# EAGLE design v2_power_board (EAGLE 9.1.0)
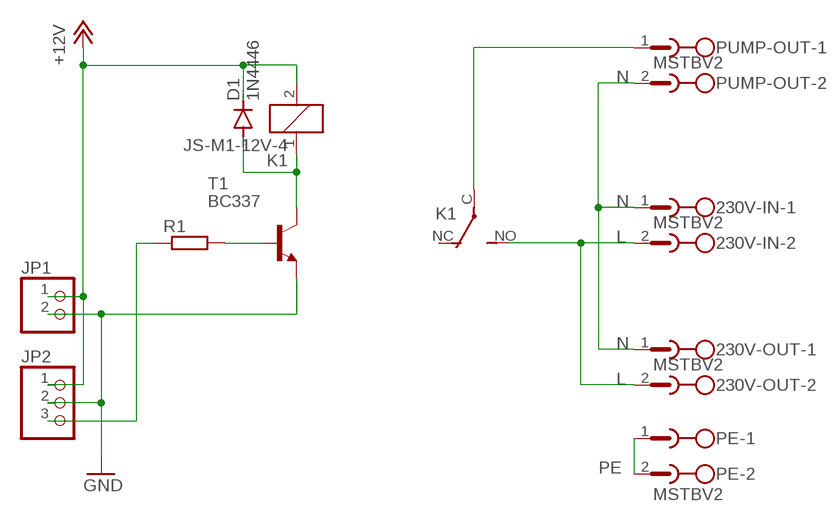
[diagram p0: schematic, sheet 1]

## Parts
230V-IN  MSTBV2  [MSTBV2]
230V-OUT  MSTBV2  [MSTBV2]
D1  1N4446  [DO35-10]
JP1  PINHD-1X2  [1X02]
JP2  PINHD-1X3  [1X03]
K1  JS-M1-12V-4  [JS-M]
PE  MSTBV2  [MSTBV2]
PUMP-OUT  MSTBV2  [MSTBV2]
R1  R-EU_R1206  [R1206]
T1  BC337  [TO92]

## Nets
+12V: D1.C JP1.1 JP2.1 K1.2
GND: JP1.2 JP2.2 T1.1(E)
L: 230V-IN.2 230V-OUT.2 K1.NO(2:S)
N: 230V-IN.1 230V-OUT.1 PUMP-OUT.2
N$6: K1.C(2:P) PUMP-OUT.1
N$8: R1.2 T1.2(B)
N$9: D1.A K1.1 T1.3(C)
N$10: JP2.3 R1.1
PE: PE.1 PE.2
Unconnected: K1.NC(2:O)

## Library data of the parts
230V-IN 230V-OUT PE PUMP-OUT = con-phoenix-508:MSTBV2: PHOENIX; MPN: MSTBV 2,5/2-GF-5.08; OC_FARNELL: 1792792; OC_NEWARK: 69R9845
D1 = diode:1N4446: DIODE high speed (Philips)
JP1 = pinhead:PINHD-1X2: PIN HEADER
JP2 = pinhead:PINHD-1X3: PIN HEADER
K1 = relay:JS-M1*: Automotive Ultra-Miniature Power Relay NAiS Source: http://www.mew-europe.com/.. en_ds_61211_0000.pdf; MPN: JSM1-12V-4; OC_FARNELL: 910338; OC_NEWARK: 13P4552
R1 = rcl:R-EU_: RESISTOR, European symbol; SPICEPREFIX: R
T1 = transistor:BC337: NPN TRANSISTOR

## Board
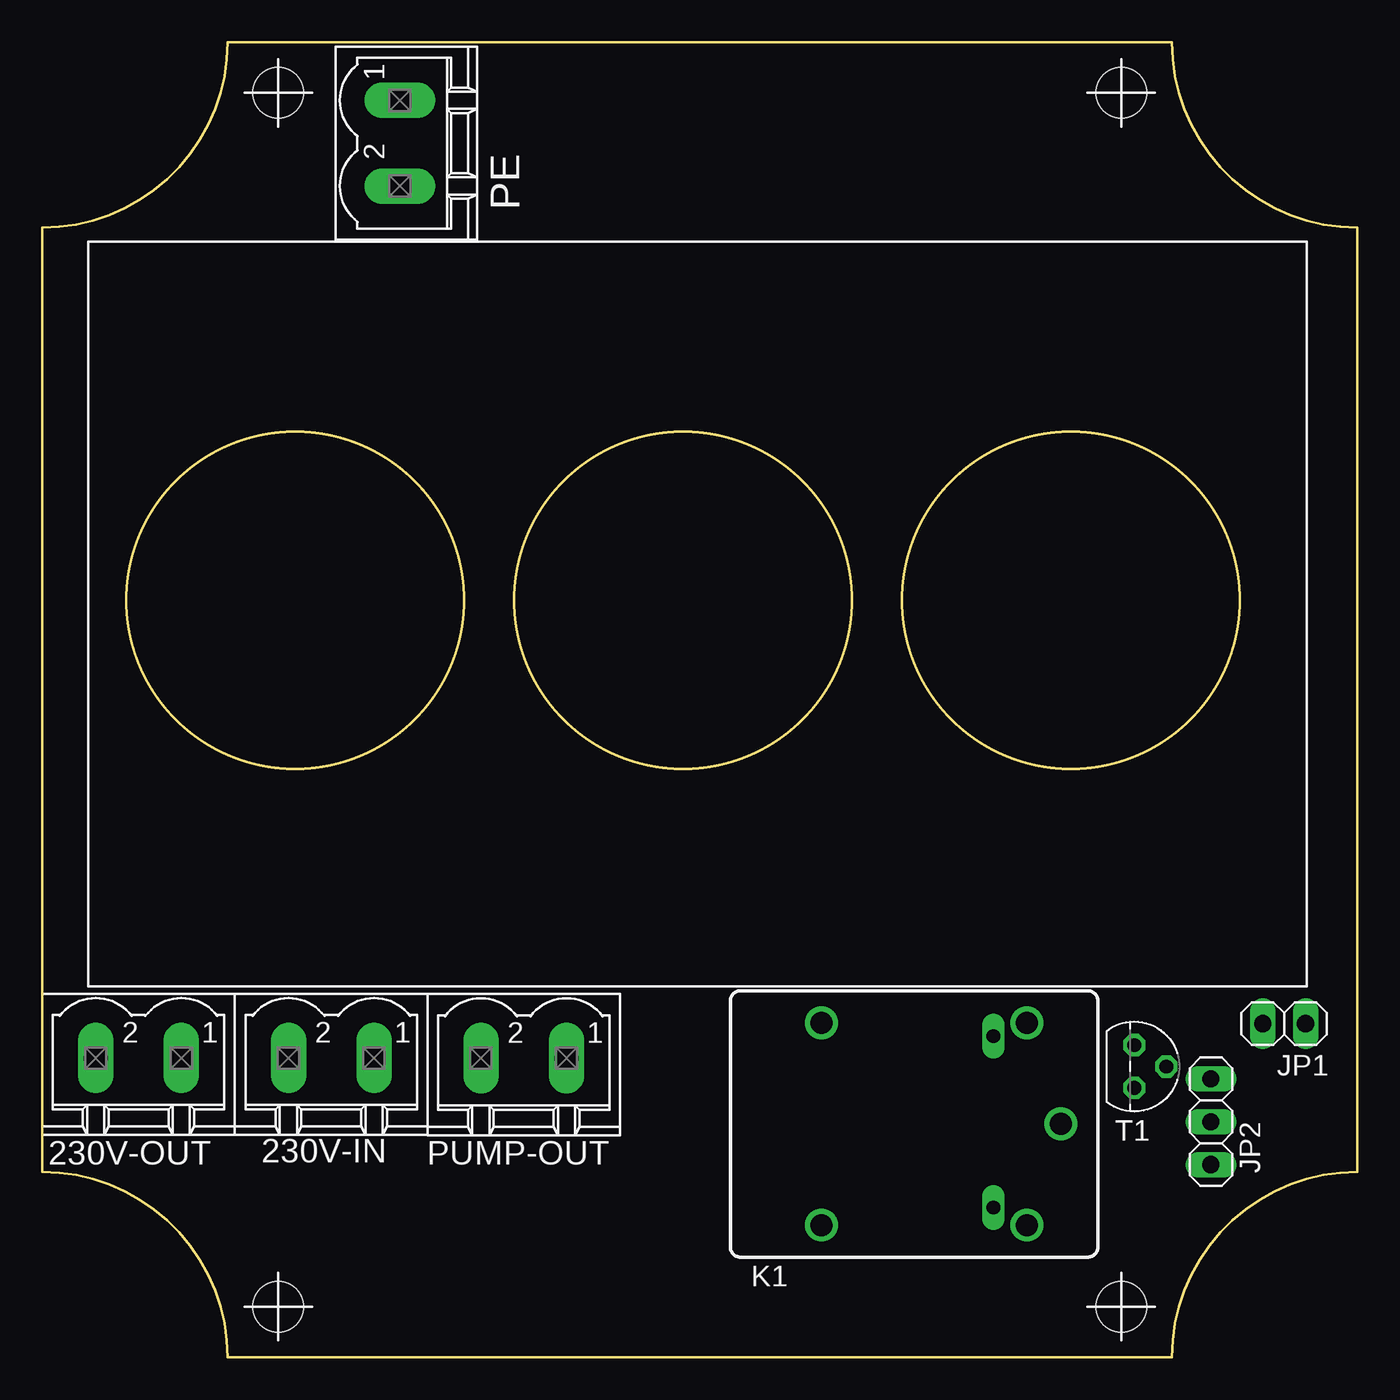
[diagram p1: board, top side]
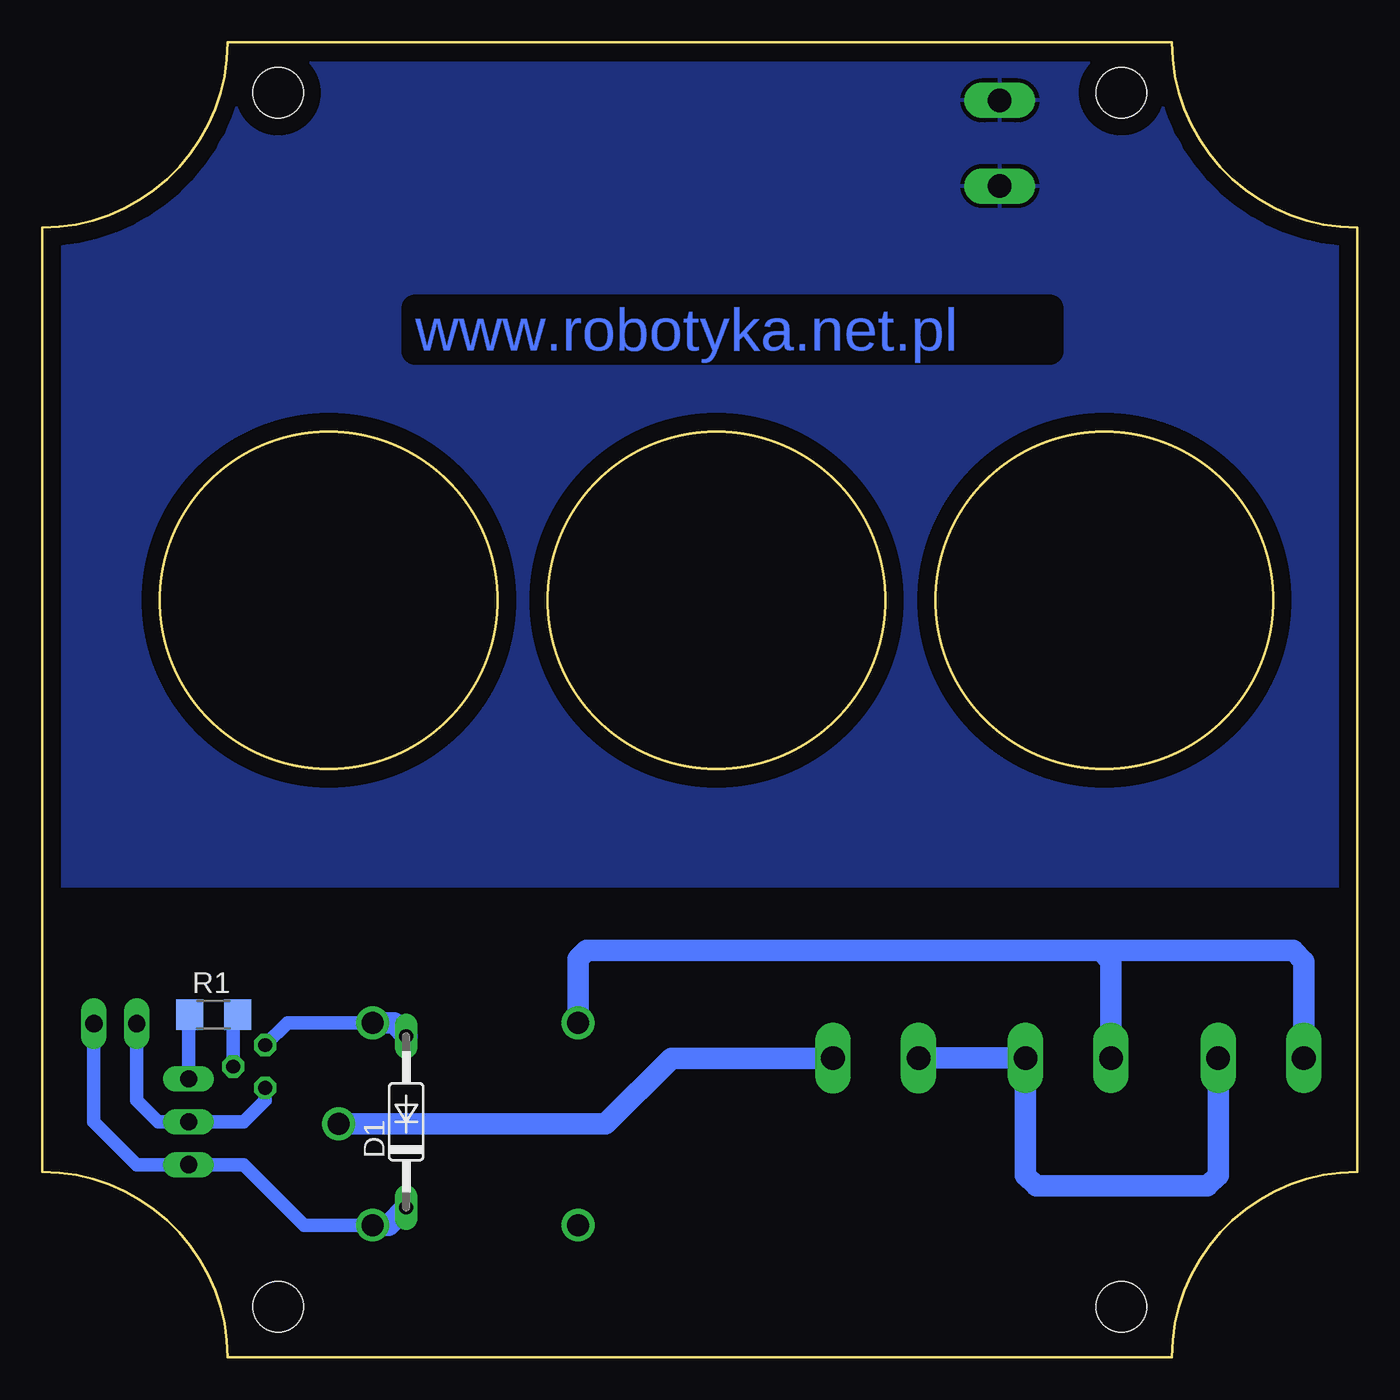
[diagram p2: board, bottom side, seen from below]

Size 78 x 78 mm. Coordinates in mm from the lower left corner, seen from the top.
Outline: 0,67 0,11 arc-90 11,0 67,0 arc-90 78,11 78,67 arc-90 67,78 11,78 arc-90 0,67
Outline: circle at 61,44.9 radius 10
Outline: circle at 38,44.9 radius 10
Outline: circle at 15,44.9 radius 10
Copper layers (1*16): Top 0.035mm / dielectric 1.5mm / Bottom 0.035mm
Design rules "default *": minimum track width 6mil, minimum drill 0.35mm, track to track 32mil, track to pad 32mil, pad to pad 6mil, via to via 6mil, smd to smd 6mil, copper to edge 40mil, drill to drill 6mil, minimum pad ring 10mil, minimum via ring 8mil, stop-mask expansion 4mil, vias tented up to drill 0mil, thermal gap 10mil
Holes 3 mm at 14,75 64,75 14,3 64,3

### Footprints (pad centres in the part's own frame; a part is rotated, then mirrored left to right if it is on the bottom)
MSTBV2 = drill 1.397 long: 1 -2.54,0; 2 2.54,0
DO35-10 = drill 0.813 long: A 5.08,0; C -5.08,0
1X02 = drill 1.016 long: 1 -1.27,0; 2 1.27,0
1X03 = drill 1.016 long: 1 -2.54,0; 2 0,0; 3 2.54,0
JS-M = drill 1.3: 1 6.7,6; 2 6.7,-6; C 8.7,0; NC -5.5,-6; NO -5.5,6
R1206 = smd 1.6 x 1.803: 1 -1.422,0; 2 1.422,0
TO92 = drill 0.813 octagon: 1 1.27,0; 2 0,1.905; 3 -1.27,0

### Placement (x,y rotation side)
230V-IN  17.14,17.76 180 top
230V-OUT  5.71,17.76 180 top
D1  56.41,13.97 90 bottom
JP1  73.66,19.79 180 top
JP2  69.32,13.97 90 top
K1  51.71,13.84 0 top
PE  21.21,72.01 270 top
PUMP-OUT  28.56,17.74 180 top
R1  67.84,20.32 0 bottom
T1  64.77,17.25 270 top

### Tracks (layer width: path | path; a pad name or v marks a point on that pad's centre or on a via)
+12V
  Bottom 0.813: JP1.1 74.93,13.97 72.39,11.43 JP2.1 66.04,11.43 62.45,7.84 K1.2
  Bottom 1.27: D1.C 57.46,7.84 K1.2
GND
  Bottom 0.813: JP1.2 72.39,15.24 71.12,13.97 JP2.2 66.04,13.97 64.77,15.24 T1.1
L
  Bottom 1.27: 230V-OUT.2 3.17,23.5 3.81,24.13 15.24,24.13 | 230V-IN.2 14.61,23.5 15.24,24.13 | K1.NO 46.21,23.64 45.72,24.13 15.24,24.13
N
  Bottom 1.27: 230V-OUT.1 8.26,10.79 8.89,10.16 19.05,10.16 19.68,10.79 230V-IN.1 26,17.76 PUMP-OUT.2
N$6
  Bottom 1.27: K1.C 44.58,13.84 40.68,17.74 PUMP-OUT.1
N$8
  Bottom 0.813: R1.2 arc-90 66.67,20.06 T1.2
N$9
  Bottom 0.813: T1.3 63.45,19.84 K1.1
  Bottom 1.27: D1.A 56.35,19.05 57.14,19.84 K1.1
N$10
  Bottom 0.813: JP2.3 69.32,20.26 R1.1
PE
  pour Bottom: 0,27.94 77.47,27.94 77.47,67.31 arc-90 67.31,77.47 11.43,77.47 arc-90 1.27,67.31 0,67.31

### Text on the board
Bottom: www.robotyka.net.pl